# EAGLE design blinkyboard (EAGLE 7.2.0)
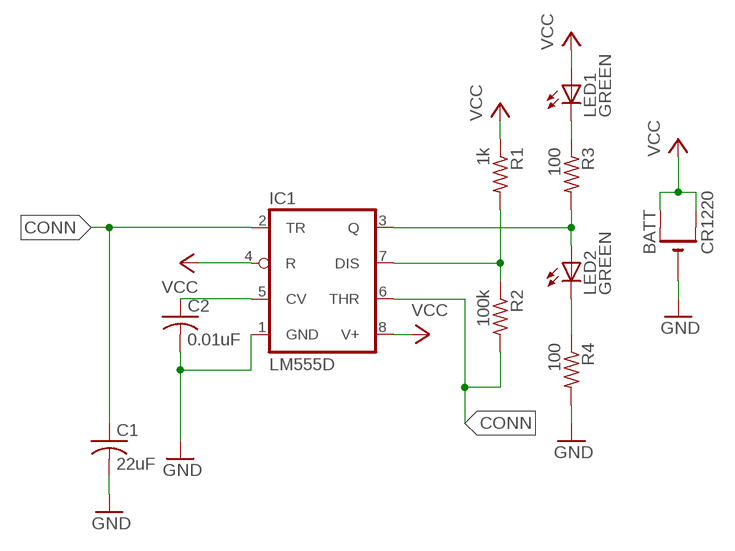
[diagram p0: schematic, sheet 1]

## Parts
BATT  CR1220  CR1220SMT  [CR1220-SMD]
C1  22uF  C-USC0805  [C0805]
C2  0.01uF  C-USC0805  [C0805]
IC1  LM555D  [SO08]
LED1  GREEN  LEDCHIPLED_0805  [CHIPLED_0805]
LED2  GREEN  LEDCHIPLED_0805  [CHIPLED_0805]
R1  1k  R-US_R0805  [R0805]
R2  100k  R-US_R0805  [R0805]
R3  100  R-US_R0805  [R0805]
R4  100  R-US_R0805  [R0805]

## Nets
CONN: C1.1 IC1.2(TR) IC1.6(THR) R2.2
GND: BATT.- C1.2 C2.2 IC1.1(GND) R4.2
N$1: LED1.C R3.1
N$2: IC1.3(Q) LED2.A R3.2
N$3: LED2.C R4.1
N$4: IC1.7(DIS) R1.2 R2.1
N$7: C2.1 IC1.5(CV)
VCC: BATT.+$1(+) BATT.+$2(+1) IC1.4(R) IC1.8(V+) LED1.A R1.1

## Library data of the parts
BATT = adafruit:CR1220: CR1216/CR1220/CR1225 12mm 3V lithium coin cell Great for battery packup. Both SMT and THM holders. Note the THM package has the ground pads on both sides of the PCB so that the masks are the same - this reduces the cost; MF: KEYSTONE; MPN: 3001; OC_FARNELL: 908642
C1 = adafruit:C-US: CAPACITOR, American symbol; MF: KEMET; MPN: C0805C226M9PACTU; OC_FARNELL: 1108326
C2 = adafruit:C-US: CAPACITOR, American symbol; MF: AVX; MPN: 04023D103KAT2A; OC_FARNELL: 1740589
IC1 = adafruit:*555: TIMER Changed DIP package to have round (not oval) pin pads http://www.ladyada.net/library/pcb/eaglelibrary.html; MF: TEXAS INSTRUMENTS; MPN: TLC555CDR; OC_FARNELL: 8454426
LED1 LED2 = adafruit:LED: LED OSRAM: - CHIPLED LG R971, LG N971, LY N971, LG Q971, LY Q971, LO R971, LY R971 LH N974, LH R974 LS Q976, LO Q976, LY Q976 LO Q996 - Hyper CHIPLED LW Q18S LB Q993, LB Q99A, LB R99A - SideLED LS A670, LO A670, LY A670, LG A670, LP A670 LB A673, LV A673, LT A673, LW A673 LH A674 LY A675 LS A676, LA A676, LO A676, LY A676, LW A676 LS A679, LY A679, LG A679 - Hyper Micro SIDELED® LS Y876, LA Y876, LO Y876, LY Y876 LT Y87S - SmartLED LW L88C, LW L88S LB L89C, LB L89S, LG L890 LS L89K, LO L89K, LY L89K LS L896, LA L896, LO L896, LY L896 - TOPLED LS T670, LO T670, LY T670, LG T670, LP T670 LSG T670, LSP T670, LSY T670, LOP T670, LYG T670 LG T671, LOG T671, LSG T671 LB T673, LV T673, LT T673, LW T673 LH T674 LS T676, LA T676, LO T676, LY T676, LB T676, LH T676, LSB T676, LW T676 LB T67C, LV T67C, LT T67C, LS T67K, LO T67K, LY T67K, LW E67C LS E67B, LA E67B, LO E67B, LY E67B, LB E67C, LV E67C, LT E67C LW T67C LS T679, LY T679, LG T679 LS T770, LO T770, LY T770, LG T770, LP T770 LB T773, LV T773, LT T773, LW T773 LH T774 LS E675, LA E675, LY E675, LS T675 LS T776, LA T776, LO T776, LY T776, LB T776 LHGB T686 LT T68C, LB T68C - Hyper Mini TOPLED® LB M676 - Mini TOPLED Santana® LG M470 LS M47K, LO M47K, LY M47K Source: http://www.osram.convergy.de/; MF: DIALIGHT; MPN: 5988170107F; OC_FARNELL: 1465996
R1 = adafruit:R-US_: RESISTOR, American symbol; MF: VISHAY DRALORIC; MPN: CRCW08051K00FKEA; OC_FARNELL: 1469847
R2 = adafruit:R-US_: RESISTOR, American symbol; MF: VISHAY DRALORIC; MPN: CRCW0805100KFKEA; OC_FARNELL: 1469860
R3 R4 = adafruit:R-US_: RESISTOR, American symbol; MF: BOURNS; MPN: CR0805-JW-101ELF; OC_FARNELL: 2333586

## Net classes
0 default: width 0.305 mm, drill 0.508 mm, clearance 0.254 mm

## Board
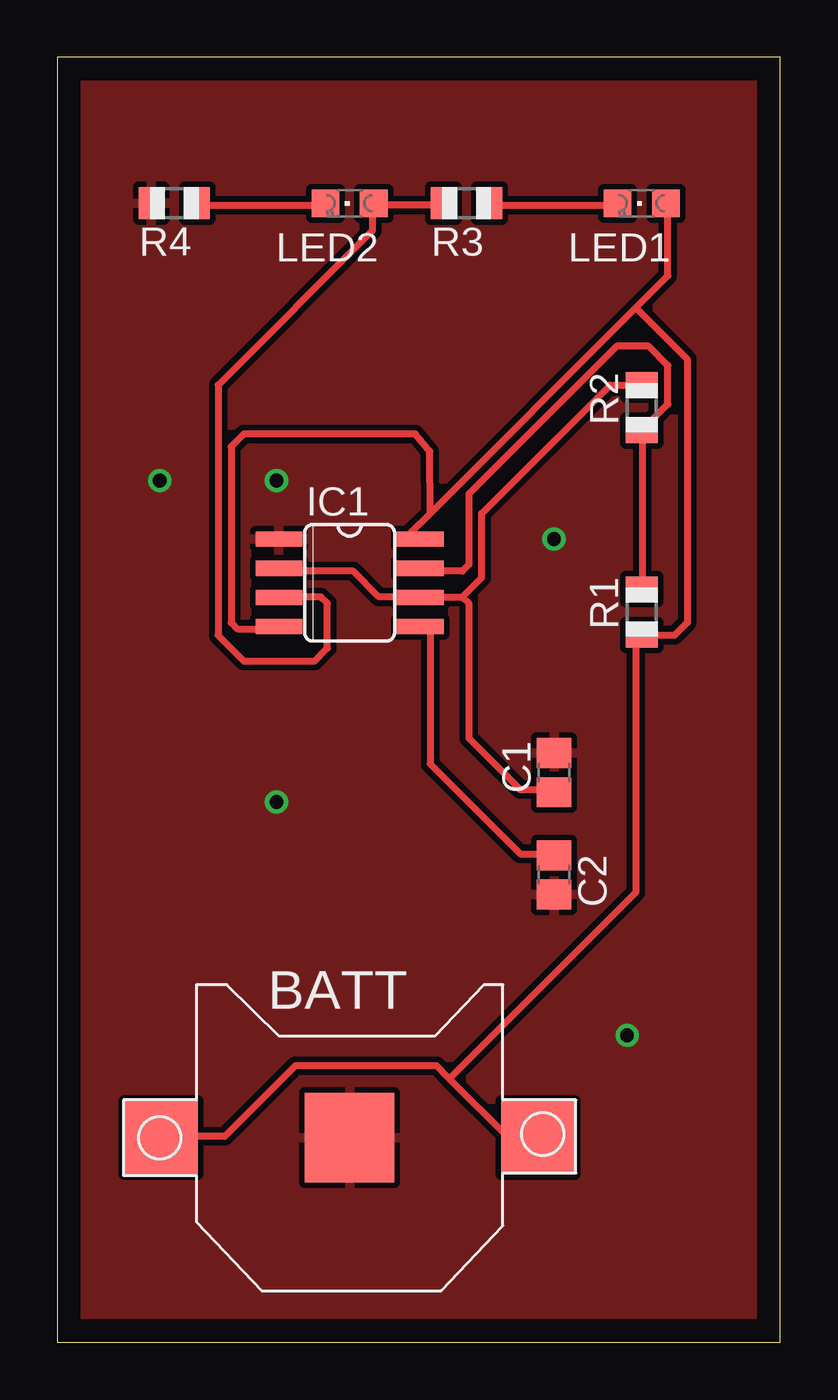
[diagram p1: board, top side]
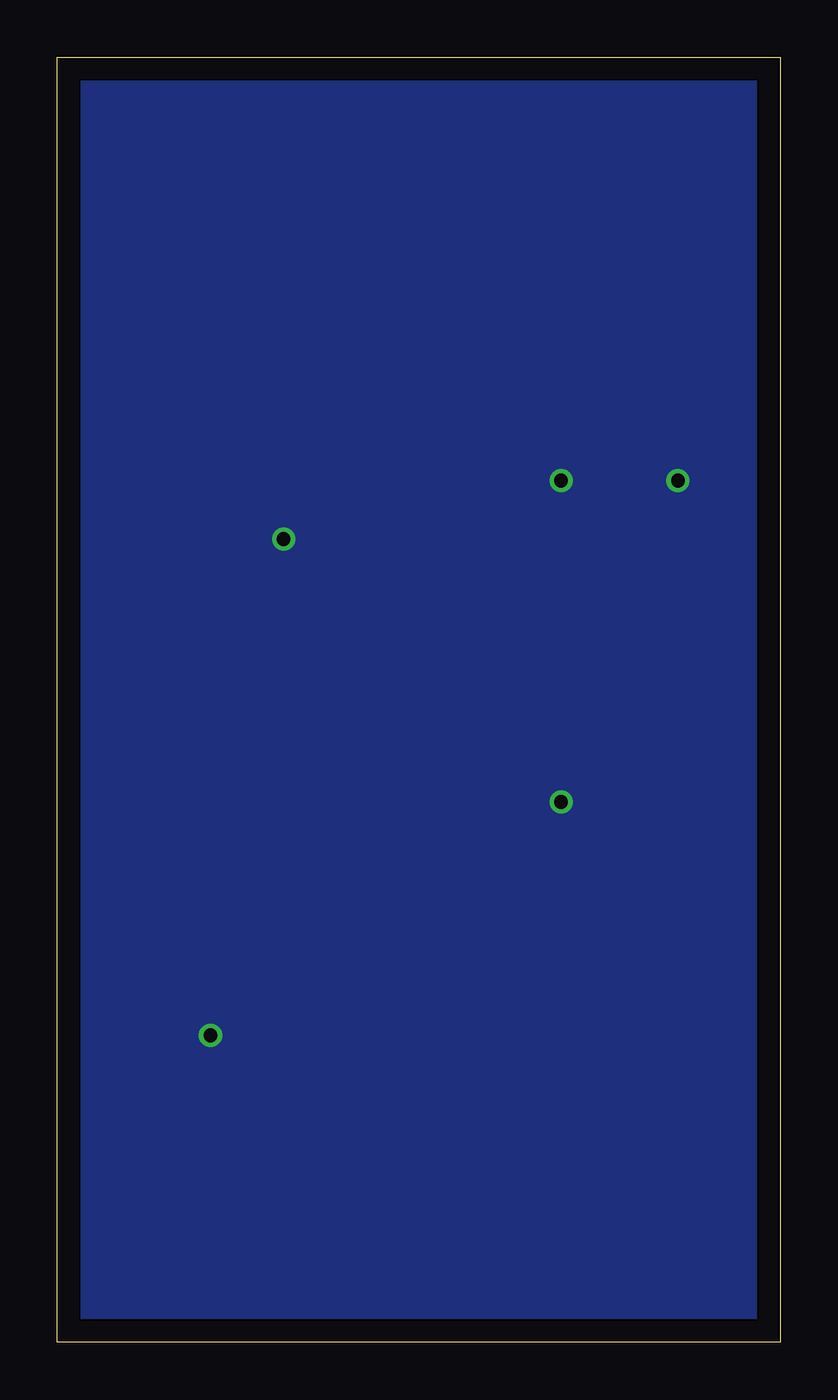
[diagram p2: board, bottom side, seen from below]

Size 31.42 x 55.87 mm. Coordinates in mm from the lower left corner, seen from the top.
Outline: 0,0 31.42,0 31.42,55.87 0,55.87 0,0
Copper layers (1*16): Top 0.035mm / dielectric 1.5mm / Bottom 0.035mm
Design rules "default *": minimum track width 10mil, minimum drill 20mil, track to track 8mil, track to pad 8mil, pad to pad 8mil, via to via 8mil, smd to smd 8mil, copper to edge 40mil, drill to drill 8mil, minimum pad ring 10mil, minimum via ring 8mil, stop-mask expansion 4mil, vias tented up to drill 0mil, thermal gap 10mil

### Footprints (pad centres in the part's own frame; a part is rotated, then mirrored left to right if it is on the bottom)
CR1220-SMD = smd 3.2 x 3.2: +$1 -8.2,0; +$2 8.2,0 | smd 3.9 x 3.9: - 0,0
C0805 = smd 1.3 x 1.5: 1 -0.85,0; 2 0.85,0
SO08 = smd 0.66 x 2.032: 1 -1.905,-3.073; 2 -0.635,-3.073; 3 0.635,-3.073; 4 1.905,-3.073; 5 1.905,3.073; 6 0.635,3.073; 7 -0.635,3.073; 8 -1.905,3.073
CHIPLED_0805 = smd 1.2 x 1.2: A 0,-1.05; C 0,1.05
R0805 = smd 1.1 x 1.4: 1 -1,0; 2 1,0

### Placement (x,y rotation side)
BATT  12.7,8.89 0 top
C1  21.59,24.77 90 top
C2  21.59,20.32 270 top
IC1  12.7,33.02 270 top
LED1  25.4,49.53 90 top
LED2  12.7,49.53 90 top
R1  25.4,31.75 90 top
R2  25.4,40.64 90 top
R3  17.78,49.53 180 top
R4  5.08,49.53 180 top

### Tracks (layer width: path | path; a pad name or v marks a point on that pad's centre or on a via)
CONN
  Top 0.305: 17.6,32.41 18.44,33.25 18.44,36.04 24.03,41.63 25.15,41.63 R2.2 | 17.6,32.41 15.93,32.41 IC1.6 15.65,32.41 13.97,32.41 12.85,33.53 9.78,33.53 IC1.2 | 17.6,32.41 17.88,32.13 17.88,26.26 20.12,24.03 21.51,24.03 C1.1
GND  (via drill 0.6)
  other vias: 9.53,37.47 4.45,37.47 9.53,23.5 21.59,34.92 24.77,13.34
  pour Top: -1.27,57.15 -1.27,-1.27 33.02,-1.27 33.02,57.15
  pour Bottom: -0.64,56.52 32.38,56.52 32.38,-0.64 -0.64,-0.64
N$1
  Top 0.305: LED1.C 24.31,49.45 19,49.45 R3.1
N$2
  Top 0.305: R3.2 16.76,49.45 13.97,49.45 LED2.A 13.69,49.45 13.69,48.34 6.99,41.63 6.99,30.73 8.1,29.62 11.18,29.62 11.73,30.18 11.73,32.13 11.46,32.41 9.78,32.41 IC1.3
N$3
  Top 0.305: LED2.C 11.46,49.45 6.15,49.45 R4.1
N$4
  Top 0.305: R1.2 25.43,32.97 25.43,39.4 R2.1 25.43,39.67 26.54,40.79 26.54,42.47 25.7,43.31 24.31,43.31 17.88,36.88 17.88,33.81 17.6,33.53 15.93,33.53 IC1.7
N$7
  Top 0.305: C2.1 21.51,21.23 20.12,21.23 16.2,25.15 16.2,31.01 15.93,31.29 IC1.5
VCC
  Top 0.305: 17.04,11.46 19.56,8.94 20.68,8.94 BATT.+$2 | 17.04,11.46 16.48,12.01 10.34,12.01 7.26,8.94 4.75,8.94 BATT.+$1 | 16.2,36.04 15.37,35.2 15.37,34.92 IC1.8 | 16.2,36.04 25.15,44.98 | 25.15,44.98 26.54,46.38 26.54,49.45 LED1.A | 25.15,44.98 27.38,42.75 27.38,31.29 26.82,30.73 25.43,30.73 R1.1 25.15,30.73 25.15,19.56 17.04,11.46 | 16.2,36.04 16.19,38.73 15.56,39.5 8.1,39.5 7.54,38.94 7.54,31.29 7.82,31.01 9.5,31.01 IC1.4